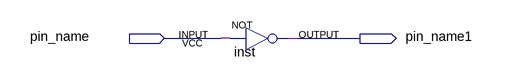
[diagram p0: schematic sheet]
// Quartus schematic no1.bdf as structural Verilog: 1 symbols, 2 pins
module no1 (
  input  pin_name,
  output pin_name1
);

  not inst (pin_name1, pin_name);
endmodule
